# EAGLE design navBoard (EAGLE 8.4.3)
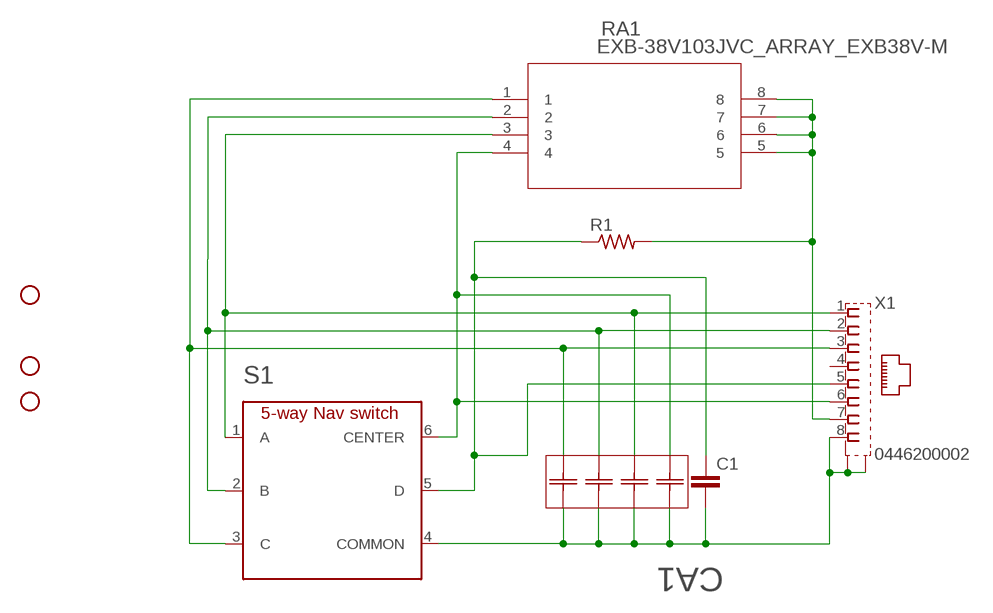
[diagram p0: schematic, sheet 1]

## Parts
C1  C-EUC0603K  [C0603K]
CA1  CKCL44X5R0J104M085AACKCL44-M  [CKCL44-M]
H1  STAND-OFF  [STAND-OFF]
H2  STAND-OFF  [STAND-OFF]
H4  STAND-OFF  [STAND-OFF]
R1  R-US_R0603  [R0603]
RA1  EXB-38V103JVC_ARRAY_EXB38V-M  [C_ARRAY_EXB38V-M]
S1  SKQUCAA010  [SKQUCAA010]
X1  0446200002  [0446200002]

## Nets
COMMON: C1.2 CA1.5 CA1.6 CA1.7 CA1.8 S1.4(COMMON) X1.8 X1.S@1(S1) X1.S@2(S2)
N$4: CA1.2 RA1.3 S1.1(A) X1.1
N$5: CA1.3 RA1.2 S1.2(B) X1.2
N$6: CA1.4 RA1.1 S1.3(C) X1.3
N$7: CA1.1 RA1.4 S1.6(CENTER) X1.6
N$8: C1.1 R1.1 S1.5(D) X1.5
N$11: R1.2 RA1.5 RA1.6 RA1.7 RA1.8 X1.7
Unconnected: X1.4

## Library data of the parts
C1 = resistor:C-EU: CAPACITOR, European symbol
CA1 = CKCL44X5R0J104M085AA:CKCL44X5R0J104M085AA; MANUFACTURER_PART_NUMBER: CKCL44X5R0J104M085AA; VENDOR: TDK
H1 H2 H4 = SparkFun-Hardware:STAND-OFF: Stand Off Drill holes for mechanically mounting via screws, standoffs, etc. Note: Use the keepout ring to avoid running the screw head into surrounding components. Variant Overviews STAND-OFF - Mechanical footprint for a #4 phillips button head screw. STAND-OFF-TIGHT - Mechanical footprint for a #4 phillips button head screw, Example SparkFun Products Screw - Phillips Head (1/4", 4-40, 10 pack) <https://www.sparkfun.com/products/10453> (PRT-10453) Screw - Phillips Head (1/2", 4-40, 10 pack) <https://www.sparkfun.com/products/10452> (PRT-10452) Screw - Phillips Head (3/4", 4-40, 10 pack) <https://www.sparkfun.com/products/10451> (PRT-10451) Screw - Phillips Head (1", 4-40, 10 pack) <https://www.sparkfun.com/products/10450> (PRT-10450)
R1 = adafruit:R-US_: RESISTOR, American symbol
RA1 = Y9103CT-ND:EXB-38V103JV; MANUFACTURER_PART_NUMBER: EXB38V103JV; VENDOR: Panasonic
S1 = nav_swich:SKQUCAA010
X1 = con-molex:0446200002: RJ-45 INVERTED MODULAR JACK ASSEMBLY WITH RJ-11 KEEPOUT FEATURE Source: Data sheet <http://www.farnell.com/datasheets/73207.pdf> MOLEX 0446200002 BUCHSE, RJ45, GESCHIRMT Source: Farnell <http://de.farnell.com/molex/0446200002/buchse-rj45-geschirmt/dp/9251910?ost=9251910>; MF: MOLEX; MPN: 0446200002; OC_FARNELL: 9251910

## Net classes
0 default: clearance 0.152 mm

## Board
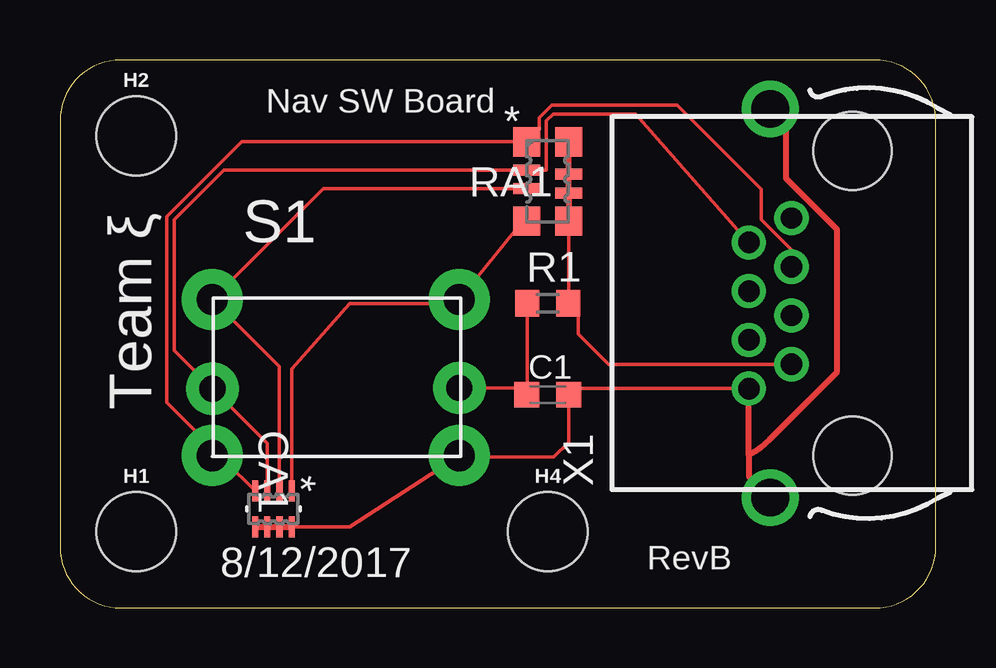
[diagram p1: board, top side]
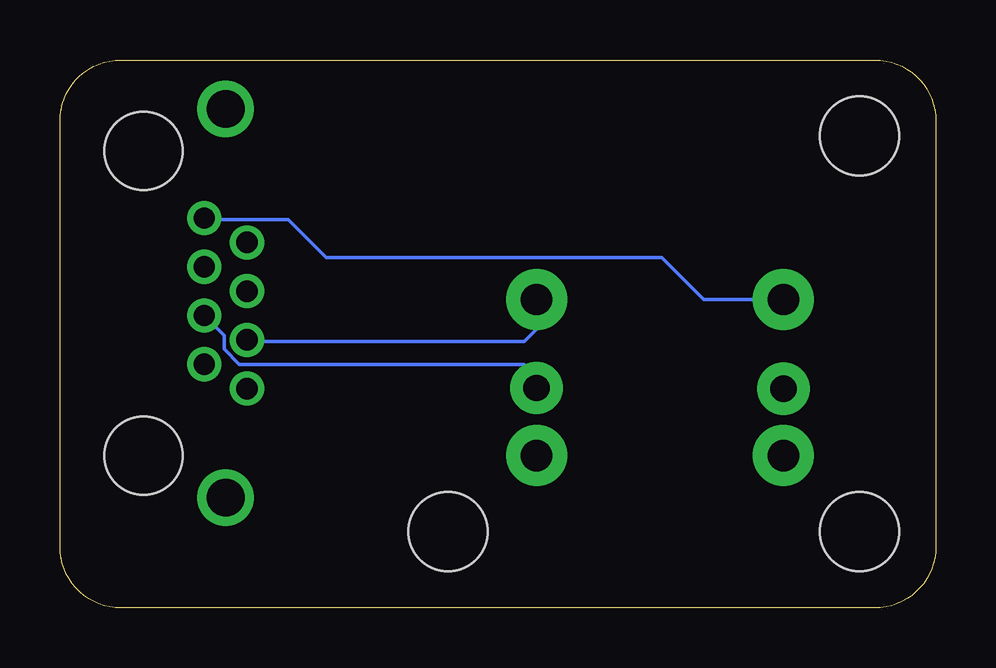
[diagram p2: board, bottom side, seen from below]

Size 36.49 x 22.85 mm. Coordinates in mm from the lower left corner, seen from the top.
Outline: 0,20.31 0,2.54 arc90 2.54,0 33.95,0 arc90 36.49,2.54 36.49,20.31 arc90 33.95,22.85 2.54,22.85 arc90 0,20.31
Copper layers (1*16): Top 0.035mm / dielectric 1.5mm / Bottom 0.035mm
Design rules "default": minimum track width 6mil, minimum drill 0.35mm, track to track 6mil, track to pad 6mil, pad to pad 6mil, via to via 6mil, smd to smd 6mil, copper to edge 40mil, drill to drill 6mil, minimum pad ring 10mil, minimum via ring 8mil, stop-mask expansion 4mil, vias tented up to drill 0mil, thermal gap 10mil

### Footprints (pad centres in the part's own frame; a part is rotated, then mirrored left to right if it is on the bottom)
C0603K = smd 1.05 x 1.08: 1 -0.875,0; 2 0.875,0
CKCL44-M = smd 0.864 x 0.254: 1 -0.749,0.762; 2 -0.749,0.254; 3 -0.749,-0.254; 4 -0.749,-0.762; 5 0.749,-0.762; 6 0.749,-0.254; 7 0.749,0.254; 8 0.749,0.762
STAND-OFF = hole 3.302: 0,0
R0603 = smd 1 x 1.1: 1 -0.85,0; 2 0.85,0
C_ARRAY_EXB38V-M = smd 1.118 x 1.219: 1 -0.876,1.651; 4 -0.876,-1.651; 5 0.876,-1.651; 8 0.876,1.651 | smd 1.118 x 0.457: 2 -0.876,0.483; 3 -0.876,-0.304; 6 0.876,-0.483; 7 0.876,0.304
SKQUCAA010 = drill 1.3 pad 2.54: 1 0,6.502; 3 0,0; 4 10.287,0; 6 10.287,6.502 | drill 1.1 pad 2.184: 2 0,2.794; 5 10.287,2.819
0446200002 = drill 0.889 pad 1.422: 1 3.556,2.54; 2 2.54,4.318; 3 1.524,2.54; 4 0.508,4.318; 5 -0.508,2.54; 6 -1.524,4.318; 7 -2.54,2.54; 8 -3.556,4.318 | drill 1.575 pad 2.286: S@1 -8.103,3.429; S@2 8.103,3.429 | hole 3.251: 6.35,0; -6.35,0

### Placement (x,y rotation side)
C1  20.32,8.89 0 top
CA1  8.89,4.13 270 top
H1  3.17,3.17 0 top
H2  3.17,19.68 0 top
H4  20.32,3.17 0 top
R1  20.32,12.7 0 top
RA1  20.32,17.78 0 top
S1  6.35,6.35 0 top
X1  33.02,12.7 90 top

### Tracks (layer width: path | path; a pad name or v marks a point on that pad's centre or on a via)
COMMON
  Top 0.152: CA1.8 12.08,3.38 16.57,6.29 | C1.2 21.2,6.91 20.57,6.29 16.57,6.29 | 21.45,9.14 X1.8 | S1.4 16.57,6.29
  Top 0.254: CA1.5 CA1.6 CA1.7 CA1.8 | C1.2 21.45,9.14 | 28.7,6.35 X1.8 | 28.7,6.35 28.7,5.49 X1.S@1 | X1.S@2 30.25,20.46 30.25,17.9 32.38,15.77 32.38,9.84 29.59,7.05 arc-14 28.7,6.35
N$4
  Top 0.152: RA1.3 10.97,17.48 S1.1 9.14,10.06 CA1.2
  Bottom 0.152: S1.1 9.68,12.85 11.43,14.61 25.4,14.61 26.99,16.19 30.42,16.19 X1.1
N$5
  Top 0.152: CA1.3 8.64,6.86 S1.2 4.76,10.73 4.76,16.19 6.83,18.26 RA1.2 20.26,18.26 20.26,20.31 20.54,20.59 23.99,20.59 X1.2
N$6
  Top 0.152: 19.64,19.95 RA1.1 | X1.3 30.48,14.92 29.21,16.19 29.21,17.46 25.72,20.95 20.48,20.95 19.96,20.43 19.96,19.95 RA1.1 | CA1.4 6.87,6.13 arc45 S1.3 6.03,6.67 6.03,6.99 4.46,8.56 4.46,16.32 7.57,19.43 RA1.1
N$7
  Top 0.152: 19.28,16.13 S1.6 | CA1.1 9.65,9.97 12.06,12.7 16.48,12.7
  Top 0.254: 19.28,16.13 RA1.4 | 16.48,12.7 S1.6
  Bottom 0.152: S1.6 16.64,11.62 17.14,11.11 28.64,11.11 X1.6
N$8
  Top 0.152: 19.47,8.91 R1.1 | 19.17,9.17 S1.5
  Top 0.254: 19.47,8.91 C1.1 19.17,9.17
  Bottom 0.152: X1.5 29.64,11.35 29.64,10.79 29.02,10.16 17.14,10.16 16.64,9.65 S1.5 16.79,9.49
N$11
  Top 0.152: 21.2,12.73 RA1.5 | R1.2 21.59,12.28 21.59,11.43 22.86,10.16 X1.7
  Top 0.254: 21.2,12.73 R1.2 | RA1.5 RA1.6 RA1.7 RA1.8

### Text on the board
tNames: Nav SW Board | Team ξ | RevB | 8/12/2017